# Altium schematic sheet t1.SchDoc
size A4; SheetNumber: 2; SheetTotal: 2
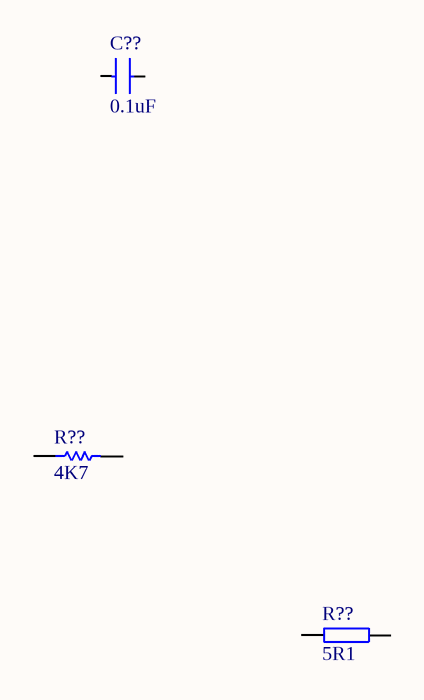
[diagram p0: t1.SchDoc]

## Parts
(Parts that share a designator on the sheet are numbered #1, #2 ... from top to bottom, then left to right.)
C??  0.1uF  [0603C]
R??#1  4K7  [0603R]
R??#2  5R1  [0805R]

## Nets

Not connected (* = marked no-connect by the designer): C?? 1 2; R??#1 1 2; R??#2 1 2

## Library data of the parts
C?? = CAP-0.1u-50v-0603: X7R AEC-Q200; PartNumber: GCJ188R71H104KA12; Manufacturer: muRata; VALUE: 0.1uF 50V 0603; TYPE: X7R AEC-Q200
R??#1 = Res1-4K7: 1%/0603; PartNumber: AC0603FR-074K7L; Manufacturer: YAGEO; VALUE: 4K7 1% 0603; TYPE: Q-200
R??#2 = Res2-5R1-0805: 1%/0805; PartNumber: AC0805FR-075R1L; Manufacturer: YAGEO; VALUE: 5R1 1% 0805 1/8W; TYPE: Q-200